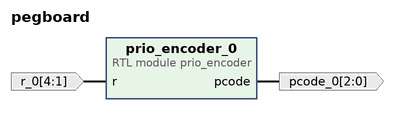
[diagram p0: block diagram of the top level]
# Vivado block design pegboard, xc7z020clg400-1, Vivado 2022.1
create_bd_design pegboard

create_bd_port -dir I -from 4 -to 1 r_0
create_bd_port -dir O -from 2 -to 0 pcode_0

create_bd_cell -type module -reference prio_encoder prio_encoder_0

# ---- connections ----

connect_bd_net [get_bd_pins prio_encoder_0/pcode] [get_bd_ports pcode_0]
connect_bd_net -net r_0_1 [get_bd_ports r_0] [get_bd_pins prio_encoder_0/r]

validate_bd_design
save_bd_design
